# Altium schematic sheet AD9833.SchDoc
size A4
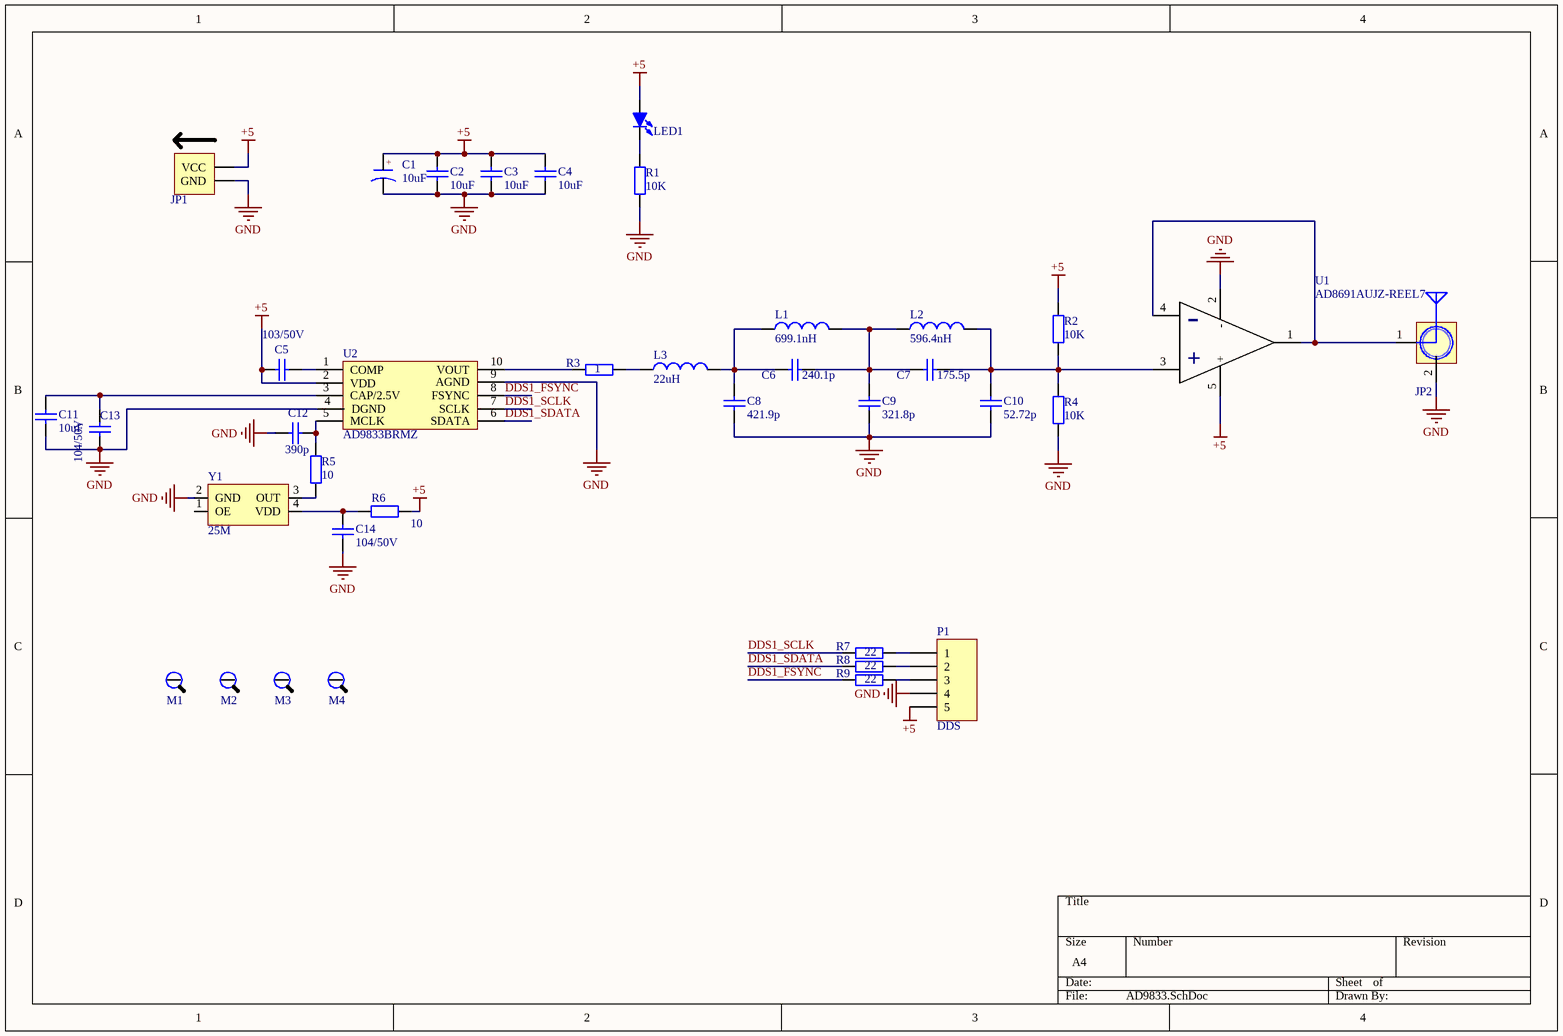
[diagram p0: AD9833.SchDoc]

## Parts
C1  value 10uF  [CASE-A_3216]  (hidden comment: CAP+)
C2  value 10uF  [C0603]  (hidden comment: CAP)
C3  value 10uF  [C0603]  (hidden comment: CAP)
C4  value 10uF  [C0603]  (hidden comment: CAP)
C5  103/50V  [C0603]
C6  240.1p  [C0603]
C7  175.5p  [C0603]
C8  421.9p  [C0603]
C9  321.8p  [C0603]
C10  52.72p  [C0603]
C11  value 10uF  [C0603]  (hidden comment: CAP)
C12  390p  [C0603]
C13  104/50V  [C0603]
C14  104/50V  [C0603]
JP1  HDR-1X2  [Power_IN_3.81-2P]  (value not drawn)
JP2  SMA WIFI 天线接口  [SMA]  (value not drawn)
L1  699.1nH  [L-0603]
L2  596.4nH  [L-0603]
L3  22uH  [L-0603]
LED1  红色  [LED 0603]  (value not drawn)
M1  M3  [M3x10_L]  (value not drawn)
M2  M3  [M3x10_L]  (value not drawn)
M3  M3  [M3x10_L]  (value not drawn)
M4  M3  [M3x10_L]  (value not drawn)
P1  DDS  [HDR1X5]
R1  value 10K  [R-0805]  (hidden comment: Res)
R2  value 10K  [R-0805]  (hidden comment: Res)
R3  1  [0603_R]
R4  value 10K  [R-0805]  (hidden comment: Res)
R5  10  [0603_R]
R6  10  [0603_R]
R7  22  [0603_R]
R8  22  [0603_R]
R9  22  [0603_R]
U1  AD8691AUJZ-REEL7  [SOT23-5N]
U2  AD9833BRMZ  [MSOP10_L]
Y1  25M  [OSC 3225-4P]

## Nets
+5: C1.1(A) C2.2 C3.2 C4.2 C5.1 JP1.1(VCC) LED1.1(A) P1.5 R2.2 R6.2 U1.5(+) U2.2(VDD)
GND: C1.2(K) C2.1 C3.1 C4.1 C8.1 C9.1 C10.1 C11.1 C12.2 C13.1 C14.1 JP1.2(GND) JP2.2 P1.4 R1.1 R4.1 U1.2(-) U2.4(DGND) U2.9(AGND) Y1.2(GND)
DDS1_FSYNC: R9.1 U2.8(FSYNC)
DDS1_SCLK: R7.1 U2.7(SCLK)
DDS1_SDATA: R8.1 U2.6(SDATA)
NetC5_2: C5.2 U2.1(COMP)
NetC6_1: C6.1 C7.2 C9.2 L1.2 L2.1
NetC6_2: C6.2 C8.2 L1.1 L3.2
NetC7_1: C7.1 C10.2 L2.2 R2.1 R4.2 U1.3(IN+)
NetC11_2: C11.2 C13.2 U2.3(CAP/2.5V)
NetC12_1: C12.1 R5.2 U2.5(MCLK)
NetC14_2: C14.2 R6.1 Y1.4(VDD)
NetJP2_1: JP2.1(SINGLE) U1.1(OUT) U1.4(IN-)
NetL3_1: L3.1 R3.2
NetLED1_2: LED1.2(K) R1.2
NetP1_1: P1.1 R7.2
NetP1_2: P1.2 R8.2
NetP1_3: P1.3 R9.2
NetR3_1: R3.1 U2.10(VOUT)
NetR5_1: R5.1 Y1.3(OUT)

Not connected (* = marked no-connect by the designer): M1 1; M2 1; M3 1; M4 1; Y1 1(OE)

## Notes on the sheet
- (in symbol 0CAP+) +

## Library data of the parts
C1 = 0CAP+: 贴片钽电容
C2-C4 C11 = 0CAP: 小功率贴片电容
C5 = 0603 10nF (103) 10% 50V: 贴片电容; ComponentLink1Description: 供应商链接; ComponentLink1URL: http://www.szlcsc.com/product/details_58143.html; Package: 0603; Supplier: LC; SuppliersPartNumber: C57112
C6-C10 = Cap: Capacitor; Value: 100pF; Published: 8-Jun-2000; LatestRevisionDate: 17-Jul-2002; LatestRevisionNote: Re-released for DXP Platform.; PackageReference: RAD-0.3; Publisher: Altium Limited; PackageDescription: Radial Cap, Thru-Hole; 2 Leads; 0.3 in Pin Spacing
C12-C14 = 0603 100nF (104) 10% 50V: 贴片电容; ComponentLink1Description: 供应商链接; ComponentLink1URL: http://www.szlcsc.com/product/details_15331.html; Package: 0603; Supplier: LC; SuppliersPartNumber: C14663
JP1 = PORT_Power_IN2: 2P接插件,模块单电源供电口; 版权归属: 源创客; BOM名称: 2P接插件; 学习资源: www.ooocke.com
JP2 = PORT_SMA: SMA-2.4G射频天线接口; 版权归属: 源创客; BOM名称: SMA-2.4G射频天线接口; 学习资源: www.ooocke.com
L1-L3 = Inductor: Code_IEC: 1005; Value: 10mH; Published: 8-Jun-2000; LatestRevisionDate: 29-May-2009; LatestRevisionNote: IPC-7351 Footprint Added.; PackageReference: 0402-A; Publisher: Altium Limited; PackageDescription: Chip Inductor; Code_JEITA: 0402
LED1 = ELSE_LED_SMD: 贴片LED
M1-M4 = ELSE_M3_screw: 螺丝
P1 = Header 5: Header, 5-Pin; LatestRevisionDate: 17-Jul-2002; LatestRevisionNote: Re-released for DXP Platform.; Publisher: Altium Limited
R1 R2 R4 = 0RES: 小功率贴片电组
R3 R5-R9 = 0603 10Ω (10R0) 1%: 贴片电阻; ComponentLink1Description: 供应商链接; ComponentLink1URL: http://www.szlcsc.com/product/details_23586.html; Package: 0603; Supplier: LC; SuppliersPartNumber: C22859
Y1 = XATLS: 贴片有源晶振; Value: 25M